# EAGLE design p7.1_3v3 - Adafruit Battery (EAGLE 9.3.1)
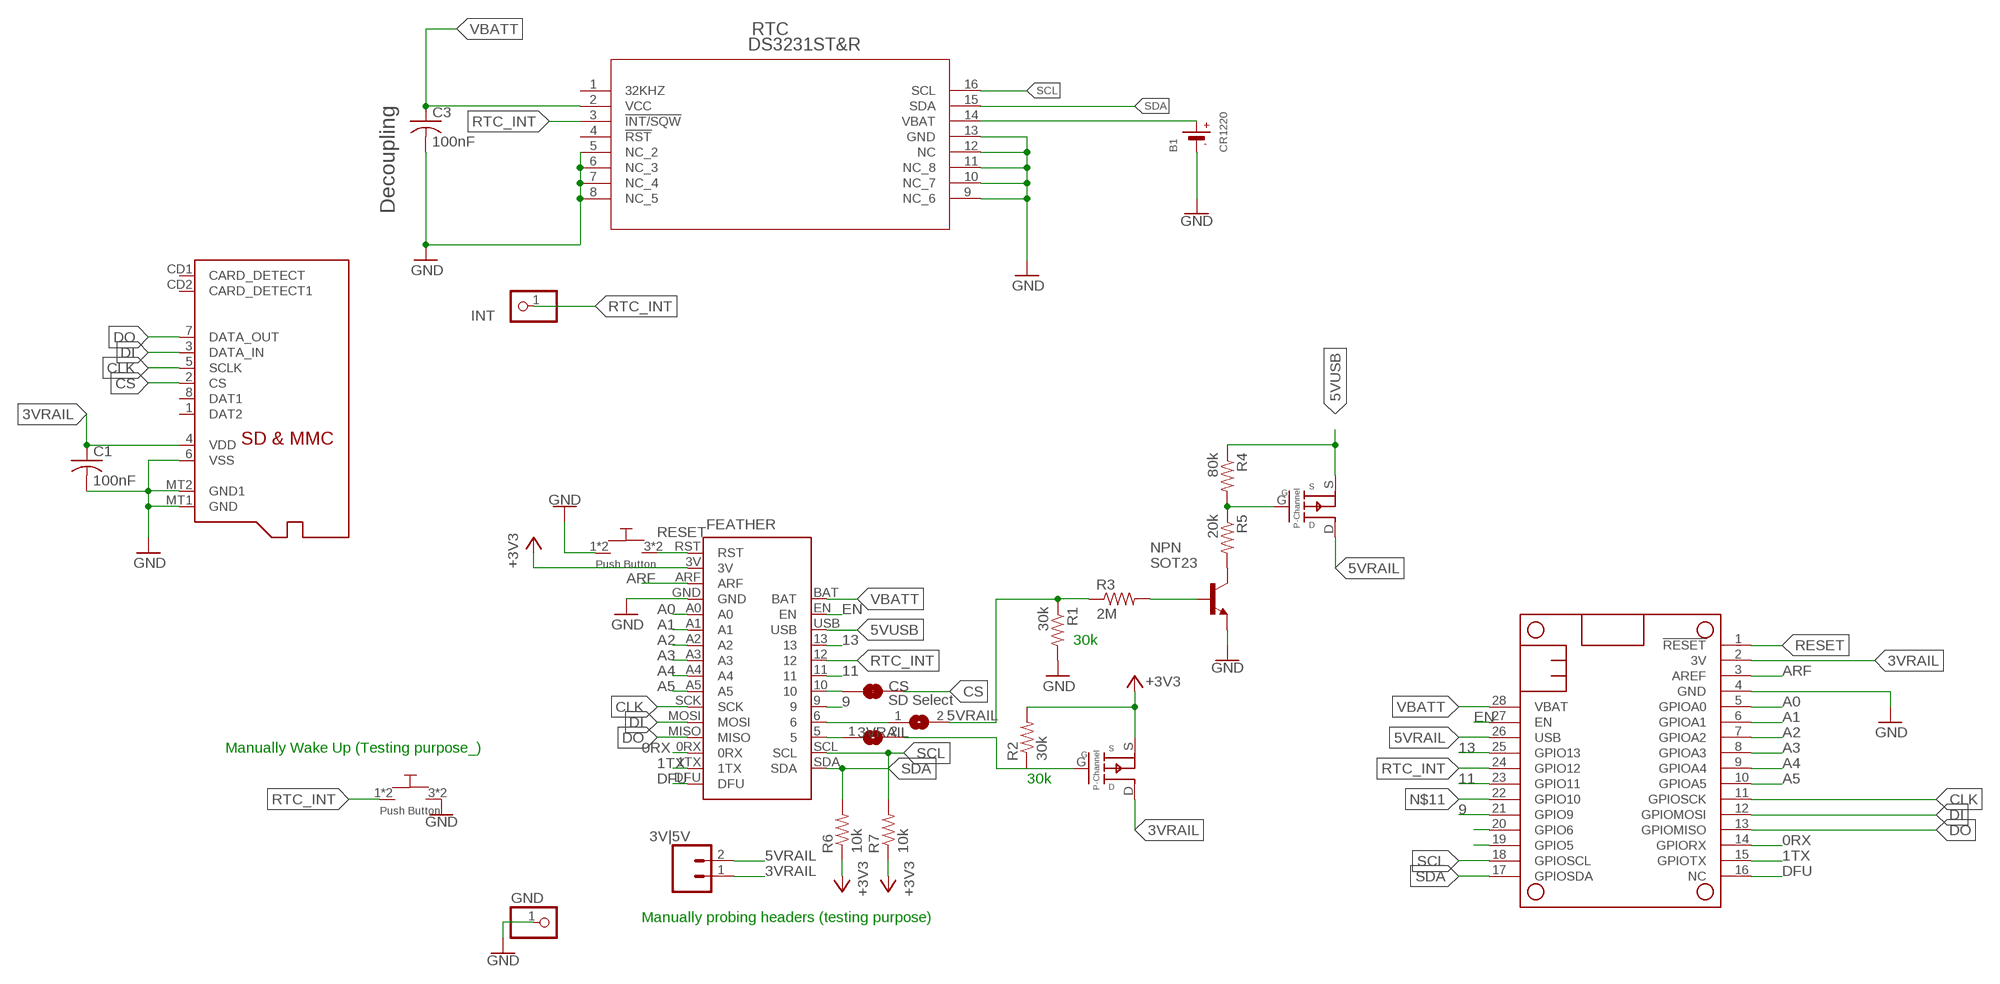
[diagram p0: schematic, sheet 1]

## Parts
3VRAIL  SJ  [SJ]
3V|5V  CONN_021X02_NO_SILK  [1X02_NO_SILK]
5VRAIL  SJ  [SJ]
B1  CR1220  BATTERYCR1220_SMT  [CR1220]
C1  100nF  C-USC1206  [C1206]
C3  100nF  C-USC1206  [C1206]
CS  SD Select  JUMPER-SMT_2_NC_TRACE_SILK  [SMT-JUMPER_2_NC_TRACE_SILK]
FEATHER  BLUEFRUIT_M0  [BLUEFRUIT_MO]
GND  PINHD-1X1  [1X01]
INT  PINHD-1X1CB  [1X01-CLEANBIG]
MICROSD  MICROSD  [MICROSD]
MS1  FEATHERWING  [FEATHERWING]
NPN  SOT23  BC849  [SOT23]
PMOS1  SSM3J3228R  [SOT-23-3]
PMOS2  SSM3J3228R  [SOT-23-3]
R1  30k  R-US_R1206  [R1206]
R2  30k  R-US_R1206  [R1206]
R3  2M  R-US_R1206  [R1206]
R4  80k  R-US_R1206  [R1206]
R5  20k  R-US_R1206  [R1206]
R6  10k  R-US_R1206  [R1206]
R7  10k  R-US_R1206  [R1206]
RTC  DS3231ST&R  [21-0042B_16]
U$1  PUSH_BUTTON  [PUSHBUTTON_SMD]
U$2  PUSH_BUTTON  [PUSHBUTTON_SMD]

## Nets
0RX: FEATHER.0RX MS1.14(GPIORX)
1TX: FEATHER.1TX MS1.15(GPIOTX)
3VRAIL: 3V|5V.1 C1.1 MICROSD.4(VDD) MS1.2(3V) PMOS2.D
5VRAIL: 3V|5V.2 MS1.26(USB) PMOS1.D
5VUSB: FEATHER.USB PMOS1.S R4.1
9: FEATHER.9 MS1.21(GPIO9)
11: FEATHER.11 MS1.23(GPIO11)
13: FEATHER.13 MS1.25(GPIO13)
+3V3: FEATHER.3V PMOS2.S R2.2 R6.1 R7.1
A0: FEATHER.A0 MS1.5(GPIOA0)
A1: FEATHER.A1 MS1.6(GPIOA1)
A2: FEATHER.A2 MS1.7(GPIOA2)
A3: FEATHER.A3 MS1.8(GPIOA3)
A4: FEATHER.A4 MS1.9(GPIOA4)
A5: FEATHER.A5 MS1.10(GPIOA5)
ARF: FEATHER.ARF MS1.3(AREF)
CLK: FEATHER.SCK MICROSD.5(SCLK) MS1.11(GPIOSCK)
CS: CS.2 MICROSD.2(CS)
DFU: FEATHER.DFU MS1.16(NC)
DI: FEATHER.MOSI MICROSD.3(DATA_IN) MS1.12(GPIOMOSI)
DO: FEATHER.MISO MICROSD.7(DATA_OUT) MS1.13(GPIOMISO)
EN: FEATHER.EN MS1.27(EN)
GND: B1.- C1.2 C3.2 FEATHER.GND GND.1 MICROSD.6(VSS) MICROSD.MT1(GND) MICROSD.MT2(GND1) MS1.4(GND) NPN.2(E) R1.2 RTC.5(NC_2) RTC.6(NC_3) RTC.7(NC_4) RTC.8(NC_5) RTC.9(NC_6) RTC.10(NC_7) RTC.11(NC_8) RTC.12(NC) RTC.13(GND) U$1.1 U$1.2 U$2.3 U$2.4
N$1: 5VRAIL.1 FEATHER.6
N$2: B1.+$1(+) RTC.14(VBAT)
N$3: 3VRAIL.1 FEATHER.5
N$4: 5VRAIL.2 R1.1 R3.1
N$5: 3VRAIL.2 PMOS2.G R2.1
N$6: NPN.1(B) R3.2
N$7: MS1.20(GPIO6)
N$8: MS1.19(GPIO5)
N$9: NPN.3(C) R5.2
N$10: PMOS1.G R4.2 R5.1
N$11: CS.1 FEATHER.10 MS1.22(GPIO10)
RESET: FEATHER.RST MS1.1(!RESET) U$1.3 U$1.4
RTC_INT [sig]: FEATHER.12 INT.1 MS1.24(GPIO12) RTC.3(!INT/SQW) U$2.1 U$2.2
SCL: FEATHER.SCL MS1.18(GPIOSCL) R7.2 RTC.16(SCL)
SDA: FEATHER.SDA MS1.17(GPIOSDA) R6.2 RTC.15(SDA)
VBATT [sig]: C3.1 FEATHER.BAT MS1.28(VBAT) RTC.2(VCC)
Unconnected: MICROSD.1(DAT2) MICROSD.8(DAT1) MICROSD.CD1(CARD_DETECT) MICROSD.CD2(CARD_DETECT1) RTC.1(32KHZ) RTC.4(!RST)

## Notes on the sheet
- Decoupling
- 30k
- Manually Wake Up (Testing purpose_)
- 30k
- Manually probing headers (testing purpose)

## Library data of the parts
3VRAIL 5VRAIL = jumper:SJ: SMD solder JUMPER
3V|5V = SparkFun-Connectors:CONN_02: Multi connection point. Often used as Generic Header-pin footprint for 0.1 inch spaced/style header connections On any of the 0.1 inch spaced packages, you can populate with these: Break Away Headers - Straight <https://www.sparkfun.com/products/116> (PRT-00116) Break Away Male Headers - Right Angle <https://www.sparkfun.com/products/553> (PRT-00553) Female Headers <https://www.sparkfun.com/products/115> (PRT-00115) Break Away Headers - Machine Pin <https://www.sparkfun.com/products/117> (PRT-00117) Break Away Female Headers - Swiss Machine Pin <https://www.sparkfun.com/products/743> (PRT-00743) For SCREWTERMINALS and SPRING TERMINALS visit here: Screw Terimnals on SparkFun.com <https://www.sparkfun.com/search/results?term=Screw+Terminals> (5mm/3.5mm/2.54mm spacing) This device is also useful as a general connection point to wire up your design to another part of your project. Our various solder wires solder well into these plated through hole pads. Hook-Up Wire - Assortment (Stranded, 22 AWG) <https://www.sparkfun.com/products/11375> (PRT-11375) Hook-Up Wire - Assortment (Solid Core, 22 AWG) <https://www.sparkfun.com/products/11367> (PRT-11367) View the entire wire category on our website here <https://www.sparkfun.com/categories/141> Special notes: Molex polarized connector foot print use with: PRT-08233 with associated crimp pins and housings. 2.54_SCREWTERM for use with PRT-10571. 3.5mm Screw Terminal footprints for PRT-08084 5mm Screw Terminal footprints for use with PRT-08432
B1 = microbuilder:BATTERY: CR1220 SMT - Digikey: 3001K-ND CD2032 BAT-HLD-001 - Digikey: BAT-HLD-001-ND
C1 C3 = adafruit:C-US: CAPACITOR, American symbol
CS = SparkFun-Jumpers:JUMPER-SMT_2_NC_TRACE: Normally closed trace jumper This jumper has a trace between two pads so it's normally closed (NC). Use a razor knife to open the connection. For best results follow the IPC guidelines for cutting traces: Cutout at least 0.063 mm (0.005 in). Remove all loose material to clean up the cut area. Seal the cut with an approved epoxy. Reapply solder to reclose the connection.
FEATHER = bluefruit_m0:BLUEFRUIT_M0: Adafruit's M0 Bluefruit / Bluetooth board layout
GND = adafruitmodified:PINHD-1X1: Pin header 1x1 for 0.1" spacing With round pins
INT = adafruit:PINHD-1X1: Pin header 1x1 for 0.1" spacing With round pins
MICROSD = adafruit:MICROSD: Micro-SD / Transflash card holder with SPI pinout For the 3M # 2908-05WB-MG and/or 4UCON #19656 push-push type
MS1 = powerboard:FEATHERWING
NPN = transistor:BC849: NPN TRANSISTOR
PMOS1 PMOS2 = M0_Power:SSM3J3228R: P-Channel MOSFET, SOT-23-3 SMD Package
R1-R7 = adafruit:R-US_: RESISTOR, American symbol
RTC = power8:DS3231ST&R: DS3231 RTC IC only; MANUFACTURER_PART_NUMBER: DS3231S#T&R; VENDOR: Maxim Integrated Products
U$1 U$2 = eDNA:PUSH_BUTTON: SMD low profile push-button NOPE https://www.mouser.com/ProductDetail/ALPS/SKTHAHE010?qs=sGAEpiMZZMsgGjVA3toVBFPD9IcV2kPoEtmOqlcDILk%3D https://www.digikey.com/product-detail/en/c-k/KMR731NG-LFS/CKN10687TR-ND/6035353 https://www.arrow.com/en/products/kmr731nglfs/ck https://www.mouser.com/ProductDetail/CK/KMR731NGLFS?qs=%2Fha2pyFaduiYmAh2YH01EjoHSsd%2F4x%252BsVgk0GVi4JwmLxfMBh2nzdw%3D%3D

## Net classes
3 sig: width 0.152 mm, clearance 0.152 mm

## Board
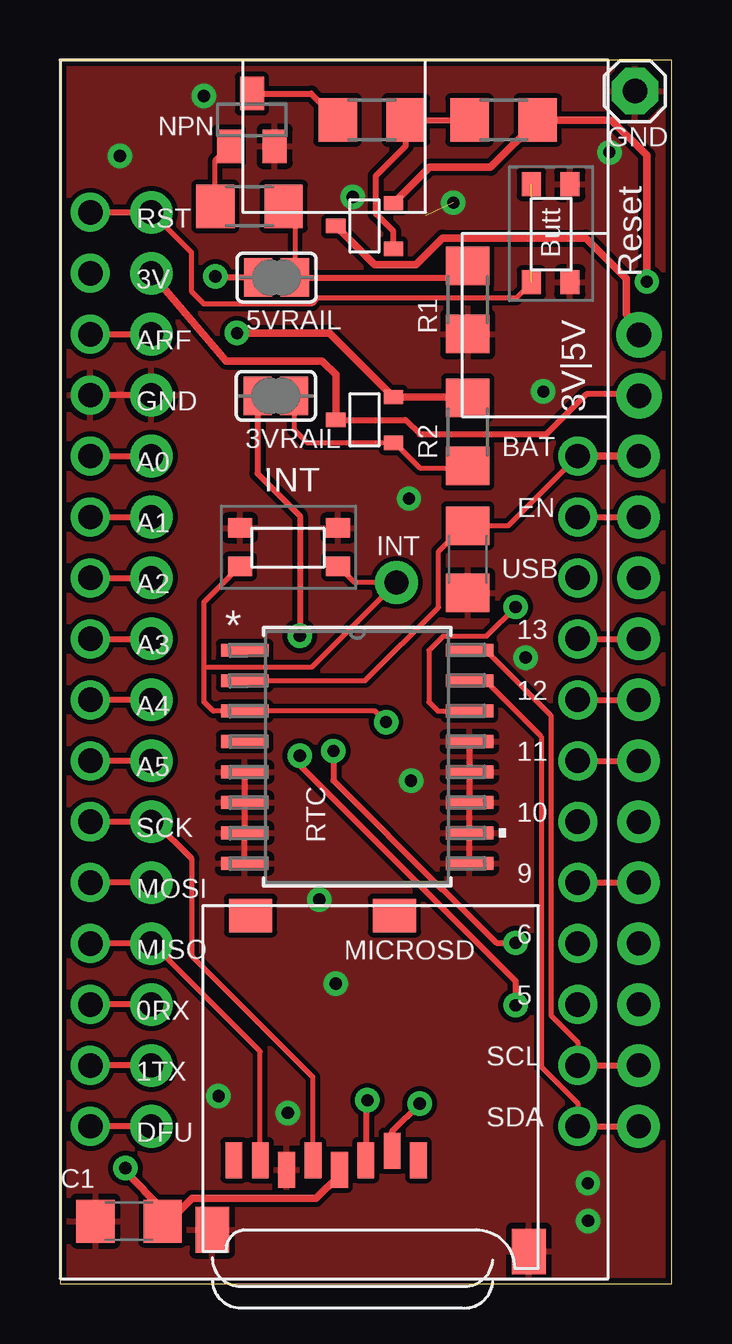
[diagram p1: board, top side]
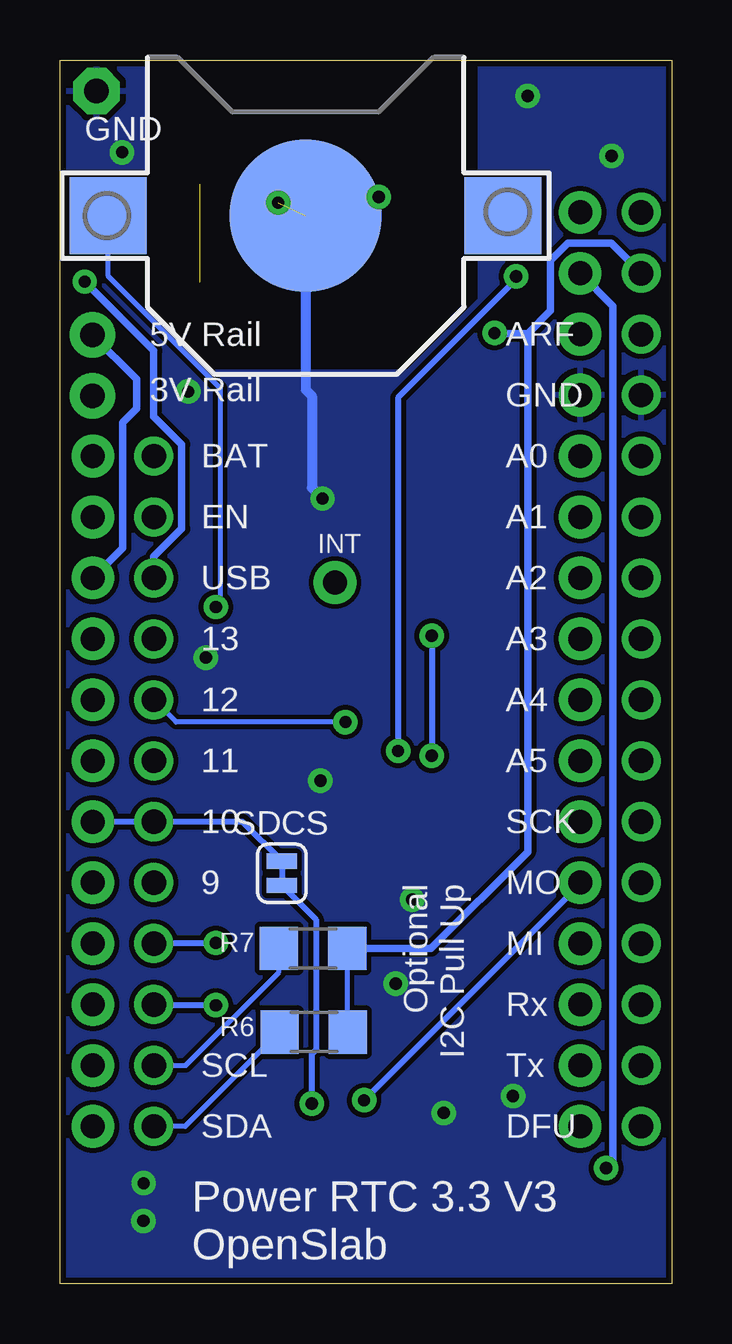
[diagram p2: board, bottom side, seen from below]

Size 25.5 x 51 mm. Coordinates in mm from the lower left corner, seen from the top.
Outline: 0,0 25.5,0 25.5,51 0,51 0,0
Copper layers (1*16): Top 0.035mm / dielectric 1.5mm / Bottom 0.035mm
Design rules "SparkFun": minimum track width 8mil, minimum drill 20mil, track to track 8mil, track to pad 8mil, pad to pad 8mil, via to via 8mil, smd to smd 8mil, copper to edge 10mil, drill to drill 8mil, minimum pad ring 12mil, minimum via ring 10mil, stop-mask expansion 4mil, vias tented up to drill 25mil, thermal gap 10mil

### Footprints (pad centres in the part's own frame; a part is rotated, then mirrored left to right if it is on the bottom)
SJ = smd 1.168 x 1.6: 1 -0.762,0; 2 0.762,0
1X02_NO_SILK = drill 1.016 pad 1.88: 1 0,0; 2 2.54,0
CR1220 = smd 3.2 x 3.2: +$1 -8.225,0; +$2 8.225,0 | smd 6.35 x 6.35: - 0,0
C1206 = smd 1.6 x 1.8: 1 -1.4,0; 2 1.4,0
SMT-JUMPER_2_NC_TRACE_SILK = smd 0.635 x 1.27: 1 -0.508,0; 2 0.508,0
BLUEFRUIT_MO = drill 1.016: 0RX 39.37,1.27; 1TX 41.91,1.27; 3V 8.89,1.27; 5 39.37,21.59; 6 36.83,21.59; 9 34.29,21.59; 10 31.75,21.59; 11 29.21,21.59; 12 26.67,21.59; 13 24.13,21.59; A0 16.51,1.27; A1 19.05,1.27; A2 21.59,1.27; A3 24.13,1.27; A4 26.67,1.27; A5 29.21,1.27; ARF 11.43,1.27; BAT 16.51,21.59; DFU 44.45,1.27; EN 19.05,21.59; GND 13.97,1.27; MISO 36.83,1.27; MOSI 34.29,1.27; RST 6.35,1.27; SCK 31.75,1.27; SCL 41.91,21.59; SDA 44.45,21.59; USB 21.59,21.59
1X01 = drill 1.016 pad 1.93 octagon: 1 0,0
1X01-CLEANBIG = drill 1.016 pad 1.778: 1 0,0
MICROSD = smd 0.7 x 1.5: 1 9,-10.64; 2 7.9,-10.24; 3 6.8,-10.64; 4 5.7,-11.04; 5 4.6,-10.64; 6 3.5,-11.04; 7 2.4,-10.64; 8 1.3,-10.64 | smd 1.8 x 1.4: CD1 2,-0.44; CD2 8,-0.44 | smd 1.4 x 1.9: MT1 0.4,-13.54; MT2 13.6,-14.44
FEATHERWING = drill 1 pad 1.778: 1 6.35,1.27; 2 8.89,1.27; 3 11.43,1.27; 4 13.97,1.27; 5 16.51,1.27; 6 19.05,1.27; 7 21.59,1.27; 8 24.13,1.27; 9 26.67,1.27; 10 29.21,1.27; 11 31.75,1.27; 12 34.29,1.27; 13 36.83,1.27; 14 39.37,1.27; 15 41.91,1.27; 16 44.45,1.27; 17 44.45,21.59; 18 41.91,21.59; 19 39.37,21.59; 20 36.83,21.59; 21 34.29,21.59; 22 31.75,21.59; 23 29.21,21.59; 24 26.67,21.59; 25 24.13,21.59; 26 21.59,21.59; 27 19.05,21.59; 28 16.51,21.59
SOT23 = smd 1 x 1.4: 1 -0.95,-1.1; 2 0.95,-1.1; 3 0,1.1
SOT-23-3 = smd 0.8 x 0.6: D 1.2,0; G -1.2,0.95; S -1.2,-0.95
R1206 = smd 1.6 x 1.803: 1 -1.422,0; 2 1.422,0
21-0042B_16 = smd 1.981 x 0.533: 1 -4.686,4.445; 2 -4.686,3.175; 3 -4.686,1.905; 4 -4.686,0.635; 5 -4.686,-0.635; 6 -4.686,-1.905; 7 -4.686,-3.175; 8 -4.686,-4.445; 9 4.686,-4.445; 10 4.686,-3.175; 11 4.686,-1.905; 12 4.686,-0.635; 13 4.686,0.635; 14 4.686,1.905; 15 4.686,3.175; 16 4.686,4.445
PUSHBUTTON_SMD = smd 1 x 0.8: 1 0,-1.6; 2 4.1,-1.6; 3 0,0; 4 4.1,0

### Placement (x,y rotation side)
3VRAIL  9,37 0 top
3V|5V  24.15,37 90 bottom
5VRAIL  9.03,41.93 0 top
B1  15.26,44.51 0 bottom
C1  2.88,2.6 180 top
C3  17,30.19 270 top
CS  16.25,17.1 270 bottom
FEATHER  0,51 270 top
GND  23.97,49.7 0 top
INT  14.03,29.22 0 top
MICROSD  5.95,15.78 0 top
MS1  2.54,51 270 top
NPN  8,48.5 0 top
PMOS1  12.7,44.08 180 top
PMOS2  12.7,36 180 top
R1  17,41 270 top
R2  17,35.5 90 top
R3  7.9,44.9 180 top
R4  18.5,48.5 180 top
R5  13,48.5 180 top
R6  14.92,10.48 180 bottom
R7  14.95,13.97 180 bottom
RTC  12.39,21.95 0 top
U$1  19.66,41.73 90 top
U$2  7.5,31.5 0 top

### Tracks (layer width: path | path; a pad name or v marks a point on that pad's centre or on a via)
0RX
  Top 0.254: MS1.14 FEATHER.0RX
1TX
  Top 0.254: MS1.15 FEATHER.1TX
3VRAIL  (via drill 0.51)
  Top 0.254: MICROSD.4 11.63,4.76 11.63,4.5 | PMOS2.D 14.4,36 15,35.4 20.28,35.4 21.95,37.07 23.54,37.07 3V|5V.1
  Top 0.305: MS1.2 6.92,38.46 10.92,38.46 11.5,37.88 PMOS2.D | v2.73,4.81 2.73,4.65 4.28,3.1 C1.1 4.56,2.6 5.5,3.55 10.68,3.55 11.63,4.5
  Bottom 0.305: MS1.2 2.44,40.74 2.44,5.1 v2.73,4.81
5VRAIL
  Top 0.305: PMOS1.D 13.11,42.47 14.85,42.47 15.95,43.58 21.92,43.58 23.61,41.89 23.61,40.4 24.15,39.86 3V|5V.2
  Bottom 0.305: 3V|5V.2 22.31,37.7 22.31,36.46 22.89,35.89 22.89,30.66 MS1.26
5VUSB  (via drill 0.51)
  Top 0.305: PMOS1.S 15.4,46.53 17.95,46.53 R4.1 22.99,48.5 24.47,47.02 v24.47,41.76
  Bottom 0.305: v24.47,41.76 21.59,38.88 21.59,36.14 20.42,34.97 20.42,31.47 21.59,30.3 FEATHER.USB
9
  Top 0.254: FEATHER.9 MS1.21
11
  Top 0.254: FEATHER.11 MS1.23
13
  Top 0.254: FEATHER.13 MS1.25
+3V3  (via drill 0.51)
  Top 0.305: v7.38,39.62 11.23,39.62 PMOS2.S 16.97,36.95 R2.2
  Bottom 0.203: R7.1 13.53,10.51 R6.1
  Bottom 0.305: 6,39.6 6,18 10.03,13.97 R7.1 | 6,39.6 7.36,39.6 v7.38,39.62 | FEATHER.3V 2.52,43.35 4.33,43.35 5.05,42.63 5.05,40.55 6,39.6
A0
  Top 0.254: FEATHER.A0 MS1.5
A1
  Top 0.254: FEATHER.A1 MS1.6
A2
  Top 0.254: FEATHER.A2 MS1.7
A3
  Top 0.254: FEATHER.A3 MS1.8
A4
  Top 0.254: MS1.9 FEATHER.A4
A5
  Top 0.254: MS1.10 FEATHER.A5
ARF
  Top 0.254: FEATHER.ARF MS1.3
CLK
  Top 0.203: MICROSD.5 10.55,8.5 10.55,8.6 5.49,13.66 5.49,17.71
  Top 0.254: FEATHER.SCK MS1.11 3.95,19.25 5.49,17.71
CS  (via drill 0.51)
  Top 0.254: v15,7.5 13.85,6.35 MICROSD.2
  Bottom 0.254: v15,7.5 15,9.58 14.83,9.75 14.83,15.17 CS.2
DFU
  Top 0.254: MS1.16 FEATHER.DFU
DI  (via drill 0.51)
  Top 0.254: MS1.12 FEATHER.MOSI | v12.82,7.64 12.75,7.57 MICROSD.3
  Bottom 0.254: v12.82,7.64 3.81,16.65 MS1.12
DO
  Top 0.203: MS1.13 3.85,14.17 3.96,14.06 8.35,9.67 MICROSD.7
  Top 0.254: MS1.13 FEATHER.MISO
EN
  Top 0.254: FEATHER.EN MS1.27
GND  (via drill 0.51)  (1 unrouted)
  Top 0.254: MS1.4 FEATHER.GND | RTC.8 RTC.7 RTC.6 RTC.5 | RTC.9 RTC.10 RTC.11 RTC.12 RTC.13
  Bottom 0.406: B1.- 15.26,37.26 15,37 15,33.17 v14.55,32.72
  other vias: 9.5,7.11 14.64,20.96 20.15,37.18 10.81,16 22.01,4.18 22.02,2.61 2.5,47 6,49.5 19.42,26.09 22.91,47.15 6.61,7.81 16.4,45.05 11.5,12.5 12.21,45.29
  pour Top: -1,51 26,51 26,0 -1,0
  pour Bottom: -0.5,51 8,51 8,41 11,38 19,38 22,41 22,51 26,51 26,0 -0.5,0
N$1  (via drill 0.51)
  Top 0.254: v19,14.2 18.2,14.2 15.99,16.41 15.95,16.41 11.4,20.96 v11.4,22.2 | 5VRAIL.1 6.53,41.93 v6.48,41.98
  Bottom 0.254: v6.48,41.98 6.48,41.84 11.4,36.92 v11.4,22.2 | v19,14.2 19.03,14.17 FEATHER.6
N$2  (via drill 0.51)
  Top 0.203: RTC.14 15.76,23.86 15.38,24.24 15.38,26.39 15.96,26.97 17.77,26.97 v19,28.2
  Bottom 0.203: v19,28.2 18.83,28.37 18.83,37.33 23.48,41.98 B1.+$1
N$3  (via drill 0.51)
  Top 0.254: 3VRAIL.1 8.24,33.76 10,32 v10,27 | v19,11.6 19,12.6 10,21.6 v10,22
  Bottom 0.254: v10,27 v10,22 | v19,11.6 21.56,11.6 FEATHER.5
N$4
  Top 0.203: R3.1 9.79,44.43 5VRAIL.2
  Top 0.254: 5VRAIL.2 16.51,41.93 R1.1
N$5
  Top 0.203: 3VRAIL.2 9.76,35.6 10.31,35.05 PMOS2.G 13.95,35.05 15,34 16.92,34 R2.1
N$6
  Top 0.203: R3.2 6.48,46.83 NPN.1
N$9
  Top 0.254: NPN.3 10.48,49.6 R5.2
N$10
  Top 0.254: R4.2 R5.1 14.42,47.42 13.17,46.17 13.17,44.59 13.9,43.86 PMOS1.G
N$11
  Bottom 0.254: MS1.22 FEATHER.10 17.89,19.25 CS.1
RESET  (1 unrouted)
  Top 0.203: U$1.3 19,41.07 10.75,41.07 10.5,40.83 6.01,40.83 5.47,41.36 5.47,42.99 MS1.1
  Top 0.254: FEATHER.RST MS1.1
RTC_INT  (via drill 0.51)
  Top 0.203: v13.6,23.4 13.14,23.86 RTC.3 6.39,23.86 6.01,24.24 6.01,25.7 | 6.01,25.7 10.51,25.7 INT.1 12.28,29.22 U$2.2 | 6.01,25.7 6.01,28.41 U$2.1
  Top 0.254: FEATHER.12 MS1.24
  Bottom 0.203: v13.6,23.4 20.66,23.4 FEATHER.12
SCL
  Top 0.203: RTC.16 17.16,26.32 17.83,26.32 20.47,23.67 20.47,11.17 21.59,10.05 FEATHER.SCL
  Top 0.254: FEATHER.SCL MS1.18
  Bottom 0.203: FEATHER.SCL 20.25,9.09 16.37,12.97 R7.2
SDA
  Top 0.203: RTC.15 17.74,25.13 20.07,22.8 20.07,9.03 21.59,7.51 FEATHER.SDA
  Top 0.254: FEATHER.SDA MS1.17
  Bottom 0.203: R6.2 20.27,6.55 FEATHER.SDA
VBATT
  Top 0.203: FEATHER.BAT 18.69,31.59 C3.1 16.86,31.59 15.78,30.51 15.78,28.18 12.73,25.13 RTC.2
  Top 0.305: FEATHER.BAT MS1.28

### Text on the board
tPlace: Butt | Reset | INT
bPlace: GND | ARF | 5V Rail | GND | 3V Rail | A0 | BAT | A1 | EN | INT | A2 | USB | A3 | 13 | A4 | 12 | A5 | 11 | SDCS | SCK | 10 | Optional / I2C Pull Up | MO | 9 | MI | Rx | Tx | SCL | DFU | SDA | Power RTC 3.3 V3 | OpenSlab